# Altium schematic sheet main_transformer.SchDoc
size A4
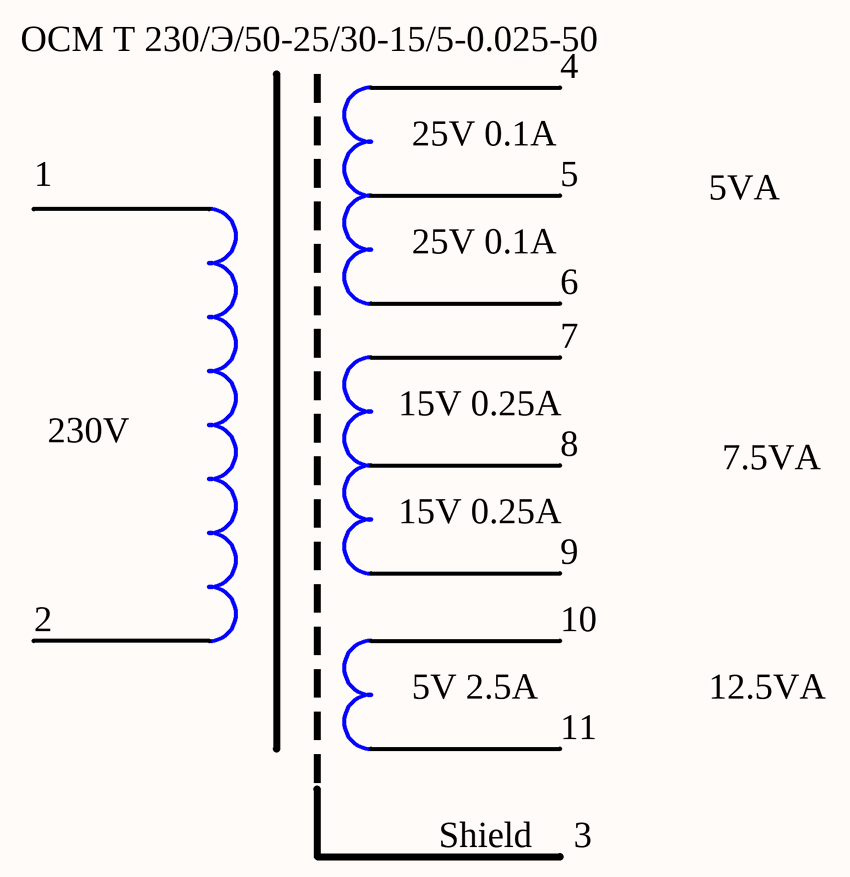
[diagram p0: main_transformer.SchDoc]

## Notes on the sheet
- ОСМ Т 230/Э/50-25/30-15/5-0.025-50
- 4
- 1
- 25V 0.1A
- 5
- 5VA
- 6
- 7
- 230V
- 15V 0.25A
- 8
- 7.5VA
- 9
- 2
- 10
- 5V 2.5A
- 11
- 12.5VA
- Shield
- 3